# Altium schematic sheet 嵌入式驱动模块.SchDoc
size A2
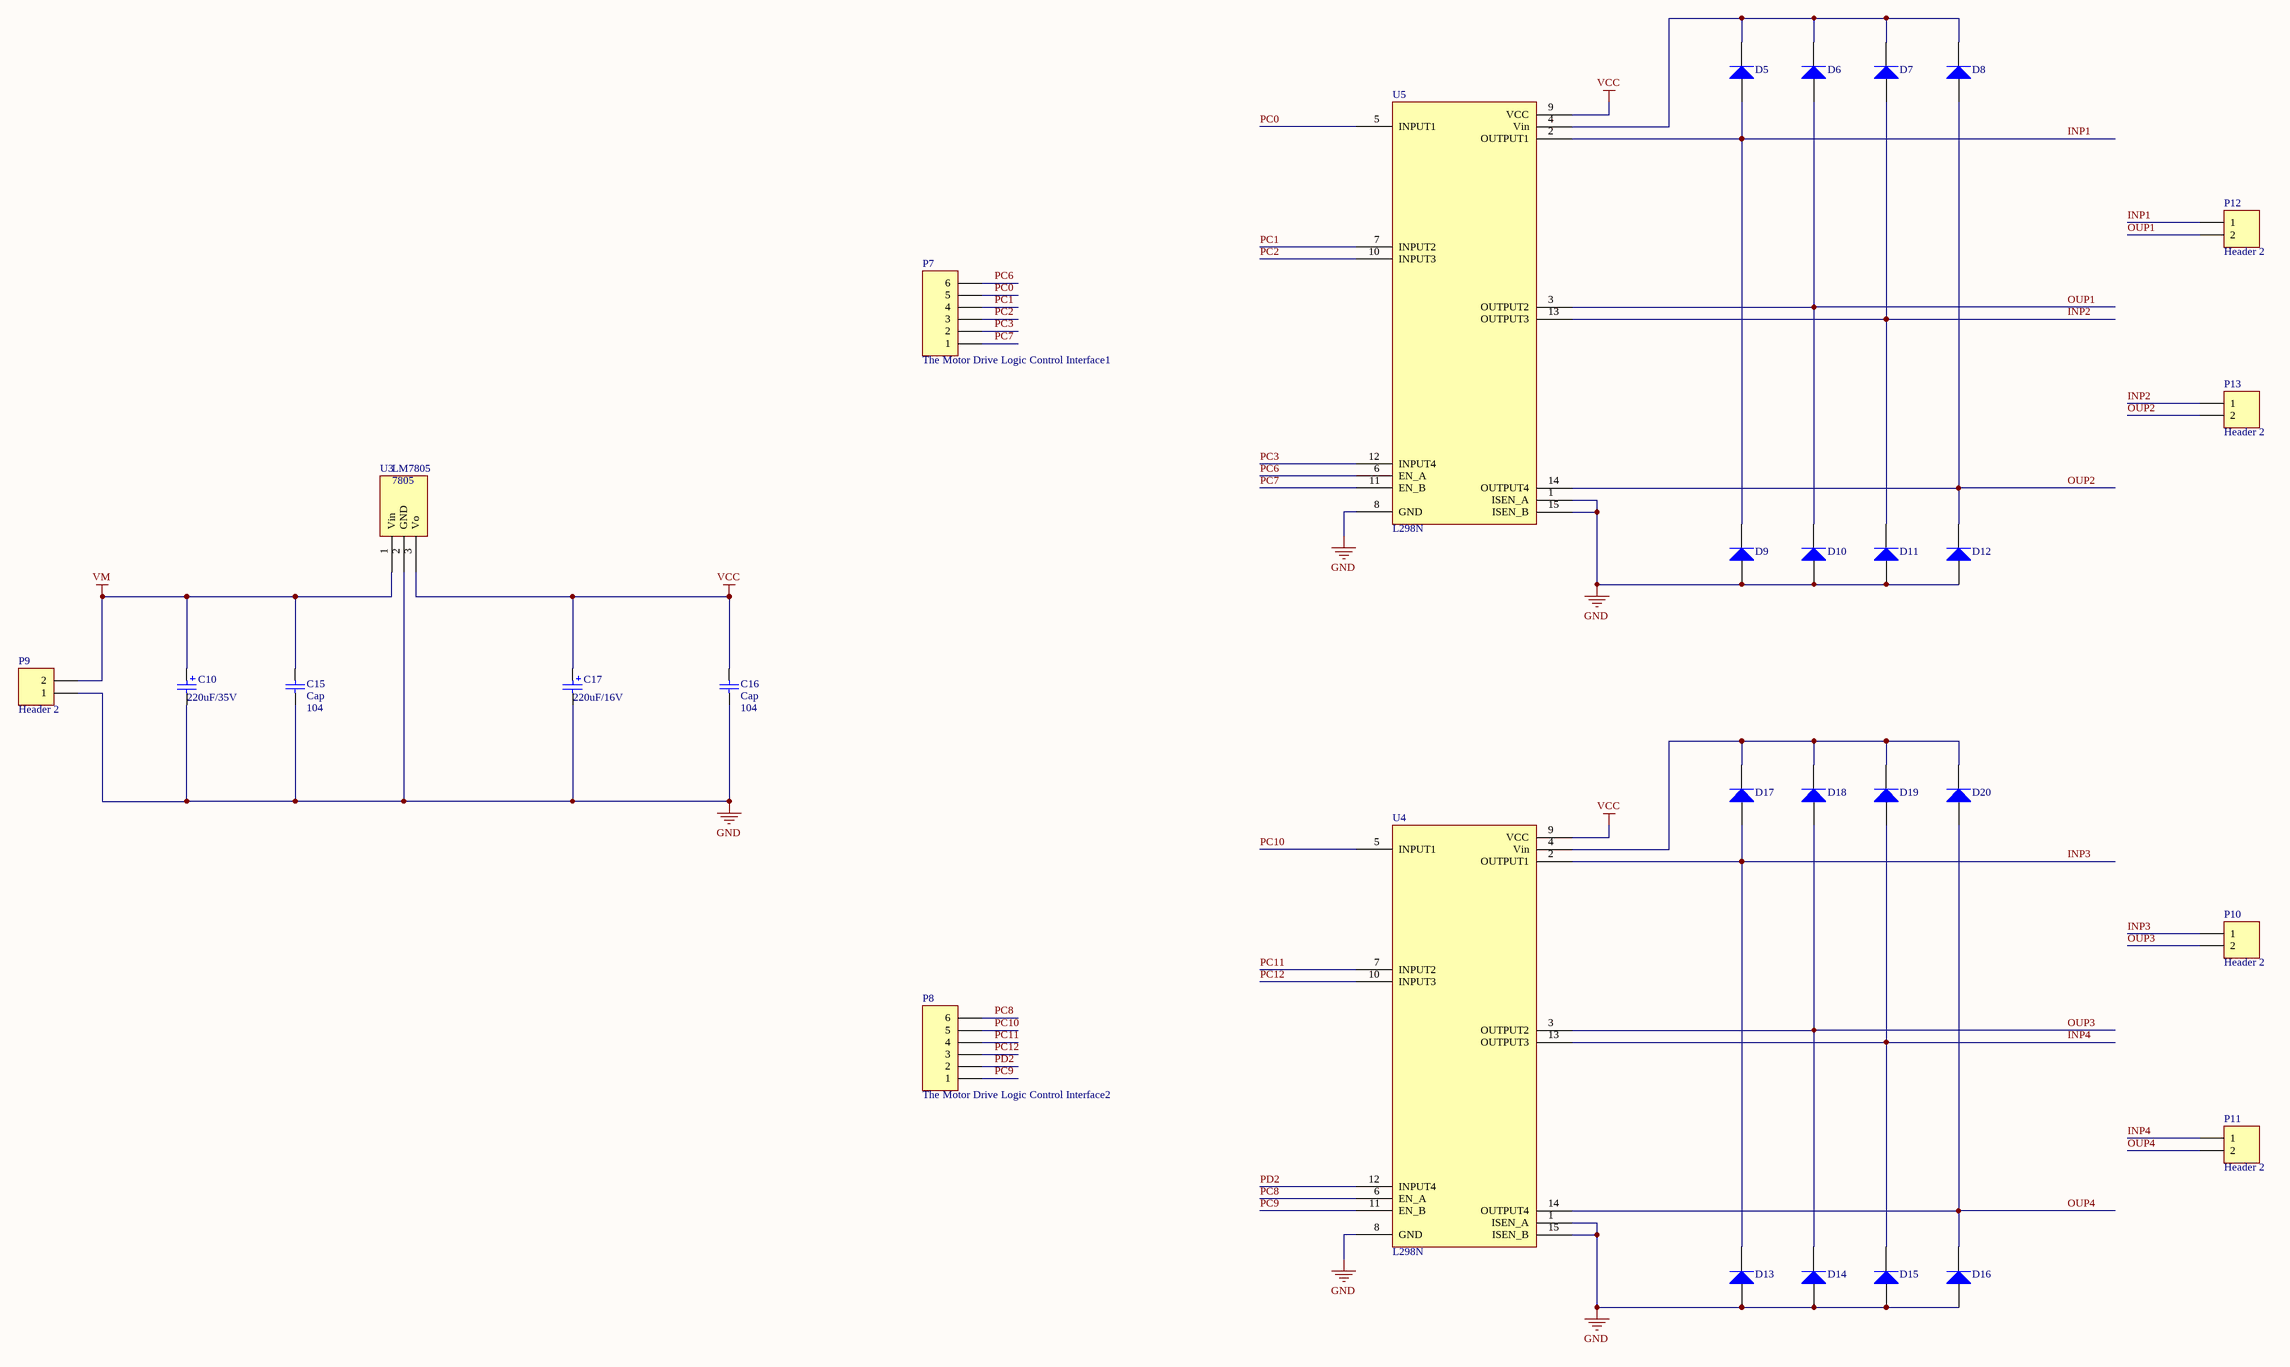
[diagram p0: 嵌入式驱动模块.SchDoc]

## Parts
C10  value 220uF/35V  [RB 5/10]  (hidden comment: Cap Pol2)
C15  Cap  value 104  [CAP-0.1]
C16  Cap  value 104  [CAP-0.1]
C17  value 220uF/16V  [RB 5/10]  (hidden comment: Cap Pol2)
D5  (no value)  [DO-41]
D6  Diode 1N914  [DO-41]  (value not drawn)
D7  Diode 1N914  [DO-41]  (value not drawn)
D8  (no value)  [DO-41]
D9  Diode 1N914  [DO-41]  (value not drawn)
D10  Diode 1N914  [DO-41]  (value not drawn)
D11  Diode 1N914  [DO-41]  (value not drawn)
D12  Diode 1N914  [DO-41]  (value not drawn)
D13  Diode 1N914  [DO-41]  (value not drawn)
D14  Diode 1N914  [DO-41]  (value not drawn)
D15  Diode 1N914  [DO-41]  (value not drawn)
D16  Diode 1N914  [DO-41]  (value not drawn)
D17  (no value)  [DO-41]
D18  Diode 1N914  [DO-41]  (value not drawn)
D19  Diode 1N914  [DO-41]  (value not drawn)
D20  (no value)  [DO-41]
P7  The Motor Drive Logic Control Interface1  [HDR-1X6]
P8  The Motor Drive Logic Control Interface2  [HDR-1X6]
P9  Header 2  [KF301-2P]
P10  Header 2  [KF301-2P]
P11  Header 2  [KF301-2P]
P12  Header 2  [KF301-2P]
P13  Header 2  [KF301-2P]
U3  LM7805  [TO-220(TO-220-3)]
U4  L298N  [L298]
U5  L298N  [L298]

## Nets
GND: C10.2 C15.1 C16.1 C17.2 D9.1(A) D10.1(A) D11.1(A) D12.1(A) D13.1(A) D14.1(A) D15.1(A) D16.1(A) P9.1 U3.2(GND) U4.1(ISEN_A) U4.8(GND) U4.15(ISEN_B) U5.1(ISEN_A) U5.8(GND) U5.15(ISEN_B)
VCC: C16.2 C17.1 U3.3(Vo) U4.9(VCC) U5.9(VCC)
VM: C10.1 C15.2 P9.2 U3.1(Vin)
INP1: D5.1(A) D9.2(K) P12.1 U5.2(OUTPUT1)
INP2: D7.1(A) D11.2(K) P13.1 U5.13(OUTPUT3)
INP3: D13.2(K) D17.1(A) P10.1 U4.2(OUTPUT1)
INP4: D15.2(K) D19.1(A) P11.1 U4.13(OUTPUT3)
OUP1: D6.1(A) D10.2(K) P12.2 U5.3(OUTPUT2)
OUP2: D8.1(A) D12.2(K) P13.2 U5.14(OUTPUT4)
OUP3: D14.2(K) D18.1(A) P10.2 U4.3(OUTPUT2)
OUP4: D16.2(K) D20.1(A) P11.2 U4.14(OUTPUT4)
PC0: P7.5 U5.5(INPUT1)
PC1: P7.4 U5.7(INPUT2)
PC2: P7.3 U5.10(INPUT3)
PC3: P7.2 U5.12(INPUT4)
PC6: P7.6 U5.6(EN_A)
PC7: P7.1 U5.11(EN_B)
PC8: P8.6 U4.6(EN_A)
PC9: P8.1 U4.11(EN_B)
PC10: P8.5 U4.5(INPUT1)
PC11: P8.4 U4.7(INPUT2)
PC12: P8.3 U4.10(INPUT3)
PD2: P8.2 U4.12(INPUT4)
NetD5_2: D5.2(K) D6.2(K) D7.2(K) D8.2(K) U5.4(Vin)
NetD17_2: D17.2(K) D18.2(K) D19.2(K) D20.2(K) U4.4(Vin)

## Notes on the sheet
- (in symbol Component_1) 7805

## Library data of the parts
C10 C17 = Cap Pol2: Polarized Capacitor (Axial); Published: 8-Jun-2000; LatestRevisionDate: 17-Jul-2002; LatestRevisionNote: Re-released for DXP Platform.; PackageReference: POLAR0.8; Publisher: Altium Limited; PackageDescription: Polarized Capacitor; 2 Leads
C15 C16 = Cap: Capacitor; Published: 8-Jun-2000; LatestRevisionDate: 17-Jul-2002; LatestRevisionNote: Re-released for DXP Platform.; PackageReference: RAD-0.3; Publisher: Altium Limited; PackageDescription: Radial Cap, Thru-Hole; 2 Leads; 0.3 in Pin Spacing
D5-D20 = Diode 1N914: High Conductance Fast Diode; Published: 8-Jun-2000; LatestRevisionDate: 17-Jul-2002; LatestRevisionNote: Re-released for DXP Platform.; DatasheetVersion: 1997; PackageReference: DO-35; Publisher: Altium Limited; PackageDescription: Diode, Axial; Body 3.8 x 1.9 mm (LxDia. max), Lead Dia. 0.53 mm (max); Code_JEDEC: DO-204-AH; ComponentLink1Description: Manufacturer Link; ComponentLink1URL: http://www.fairchildsemi.com/; ComponentLink2Description: Datasheet; ComponentLink2URL: http://www.fairchildsemi.com/ds/1N%2F1N4448.pdf
P7 P8 = Header 6: Header, 6-Pin; LatestRevisionDate: 17-Jul-2002; LatestRevisionNote: Re-released for DXP Platform.; Publisher: Altium Limited
P9-P13 = Header 2: Header, 2-Pin; LatestRevisionDate: 17-Jul-2002; LatestRevisionNote: Re-released for DXP Platform.; Publisher: Altium Limited
U3-U5 = Component_1